# Altium schematic sheet LMR14050_mod2.SchDoc
size B
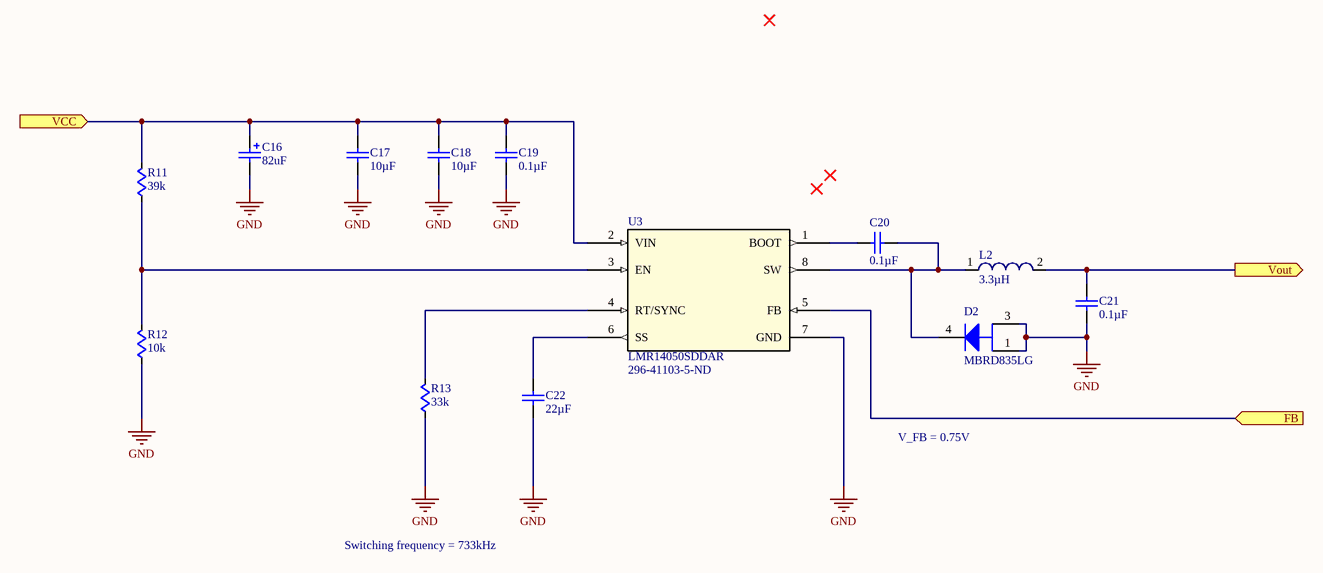
[diagram p0: LMR14050_mod2.SchDoc]

## Parts
C16  value 82uF  [CAP_EEFK_D8]  (hidden comment: EEEFK1V680XP)
C17  value 10µF  [C0805]  (hidden comment: Cap)
C18  value 10µF  [C0805]  (hidden comment: Cap)
C19  value 0.1µF  [C0805]  (hidden comment: Cap)
C20  value 0.1µF  [C0805]  (hidden comment: Cap)
C21  value 0.1µF  [C0805]  (hidden comment: Cap)
C22  value 22µF  [C0805]  (hidden comment: Cap)
D2  MBRD835LG  [ONSC-DPAK-3-369C-01_V]
L2  value 3.3µH  [IHLP-2525C7]  (hidden comment: Ind)
R11  value 39k  [R0805]  (hidden comment: Res)
R12  value 10k  [R0805]  (hidden comment: Res)
R13  value 33k  [R0805]  (hidden comment: Res)
U3  LMR14050SDDAR  Supplier Part Number 1: 296-41103-5-ND  [DDA8]

## Ports
FB (in), VCC (in), Vout (out)

## Nets
GND: C16.2 C17.1 C18.1 C19.1 C21.1 C22.1 D2.1(A) D2.3(A) R12.1 R13.1 U3.7(GND)
FB: U3.5(FB) ; port FB
VCC: C16.1 C17.2 C18.2 C19.2 R11.2 U3.2(VIN) ; port VCC
Vout: C21.2 L2.2 ; port Vout
NetC20_1: C20.1 D2.4(K) L2.1 U3.8(SW)
NetC20_2: C20.2 U3.1(BOOT)
NetC22_2: C22.2 U3.6(SS)
NetR11_1: R11.1 R12.2 U3.3(EN)
NetR13_2: R13.2 U3.4(RT/SYNC)

## Notes on the sheet
- V_FB = 0.75V
- Switching frequency = 733kHz

## Library data of the parts
C16 = EEEFK1V680XP: Polarized Capacitor (Surface Mount); Vendor: Panasonic; Built_By: EMA_UL_Team; C: Copyright (C) 2015 Accelerated Designs. All rights reserved; Manufacturer_Part_Number: EEEFK1V680XP; Supplier 1: Digi-Key; Supplier Part Number 1: P18960DKR-ND
C17-C22 = Cap: capacitor
D2 = CMP-1055-00169-1: SWITCHMODE(TM) Power Rectifier, 3-Pin DPAK, Pb-Free, Tube; Manufacturer: On Semiconductor; IFSM Max (A): 75; Configuration: Single; RoHS: TRUE; ComponentLink1Description: Manufacturer URL; PackageDescription: 3-Pin Flange Mount, Body 6.54 x 6.095 mm, Pitch 2.29 mm; Packing: Tube; ComponentLink2URL: http://www.onsemi.cn/pub_link/Collateral/MBRD835L-D.PDF; DatasheetVersion: Rev. 11; PackageVersion: Rev. E, 02/2014; ComponentLink3URL: http://www.onsemi.cn/pub_link/Collateral/369C.PDF; ComponentLink1URL: http://www.onsemi.com/; PackageReference: DPAK-3-369C-01; ComponentLink2Description: Datasheet; Mounting Technology: Surface Mount; ComponentLink3Description: Package Specification; PartNumber: MBRD835LG
L2 = Ind: Inductor; Supplier 1: Digi-Key; Supplier Part Number 1: 541-2580-1-ND
R11-R13 = Res: resistor
U3 = LMR14050SDDAR: dc-dc converter; Vendor: Texas Instruments; Built_By: EMA_UL_Team; C: Copyright (C) 2016 Accelerated Designs. All rights reserved; Manufacturer_Part_Number: LMR14050SDDAR; Value: Value; Type: Type; RefDes: RefDes; Supplier 1: Digi-Key